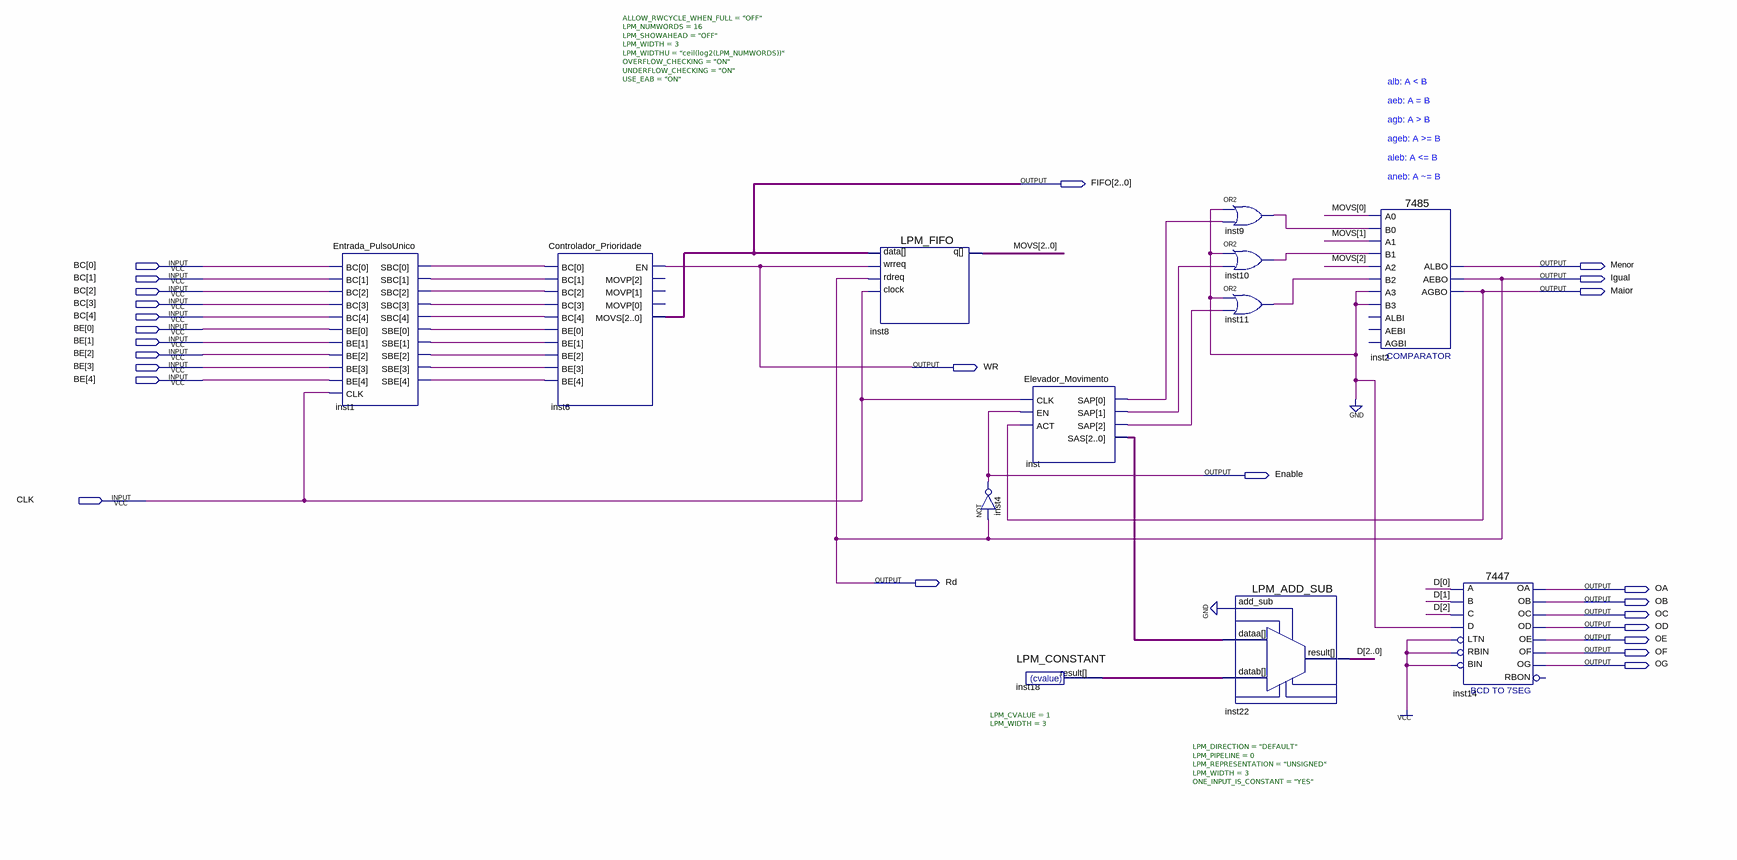
[diagram p0: schematic sheet]
// Quartus schematic Elevador_BetaV2.bdf as structural Verilog: 12 symbols, 25 pins
module Elevador_BetaV2 (
  input  [4:0] BC,
  input  [4:0] BE,
  input  CLK,
  output [2:0] FIFO,
  output Menor,
  output Igual,
  output Maior,
  output WR,
  output Enable,
  output Rd,
  output OA,
  output OB,
  output OC,
  output OD,
  output OE,
  output OF,
  output OG
);

  wire inst1_sbc, inst1_sbc_2, inst1_sbc_3, inst1_sbc_4, inst1_sbc_5, inst1_sbe, inst1_sbe_2, inst1_sbe_3,
       inst1_sbe_4, inst1_sbe_5, inst9_out, inst10_out, inst11_out, inst_sap, inst_sap_2, inst_sap_3;
  wire [2:0] D, inst18_result, inst_sas, MOVS;

  Entrada_PulsoUnico inst1 (
    .BC(BC), .BE(BE), .CLK(CLK), .SBC({inst1_sbc_5, inst1_sbc_4, inst1_sbc_3, inst1_sbc_2, inst1_sbc}),
    .SBE({inst1_sbe_5, inst1_sbe_4, inst1_sbe_3, inst1_sbe_2, inst1_sbe}));
  Controlador_Prioridade inst6 (
    .BC({inst1_sbc_5, inst1_sbc_4, inst1_sbc_3, inst1_sbc_2, inst1_sbc}),
    .BE({inst1_sbe_5, inst1_sbe_4, inst1_sbe_3, inst1_sbe_2, inst1_sbe}), .EN(WR), .MOVS(FIFO));  // open: MOVP
  LPM_FIFO #(.ALLOW_RWCYCLE_WHEN_FULL("OFF"), .LPM_NUMWORDS(16), .LPM_SHOWAHEAD("OFF"), .LPM_WIDTH(3), .LPM_WIDTHU("ceil(log2(LPM_NUMWORDS))"), .OVERFLOW_CHECKING("ON"), .UNDERFLOW_CHECKING("ON"), .USE_EAB("ON")) inst8 (
    .clock(CLK), .data(FIFO), .rdreq(Igual), .wrreq(WR), .q(MOVS));
  Elevador_Movimento inst (
    .CLK(CLK), .EN(Enable), .ACT(Maior), .SAP({inst_sap_2, inst_sap, inst_sap_3}), .SAS(inst_sas));
  not inst4 (Enable, Igual);
  LPM_CONSTANT #(.LPM_CVALUE(1), .LPM_WIDTH(3)) inst18 (.result(inst18_result));
  or inst9 (inst9_out, 1'b0, inst_sap_3);
  or inst10 (inst10_out, 1'b0, inst_sap);
  or inst11 (inst11_out, 1'b0, inst_sap_2);
  LPM_ADD_SUB #(.LPM_DIRECTION("DEFAULT"), .LPM_PIPELINE(0), .LPM_REPRESENTATION("UNSIGNED"), .LPM_WIDTH(3), .ONE_INPUT_IS_CONSTANT("YES")) inst22 (
    .add_sub(1'b0), .dataa(inst_sas), .datab(inst18_result), .result(D));
  \7485  inst2 (
    .A3(1'b0), .B2(inst11_out), .A2(MOVS[2]), .A0(MOVS[0]), .B0(inst9_out), .B3(1'b0), .A1(MOVS[1]),
    .B1(inst10_out), .ALBO(Menor), .AGBO(Maior), .AEBO(Igual));  // open: AEBI, AGBI, ALBI
  \7447  inst14 (
    .LTN(1'b1), .B(D[1]), .C(D[2]), .D(1'b0), .RBIN(1'b1), .BIN(1'b1), .A(D[0]), .OB(OB), .OC(OC), .OE(OE),
    .OD(OD), .OF(OF), .OG(OG), .OA(OA));  // open: RBON

  assign Rd = Igual;

  // Notes on the sheet:
  //   alb: A < B
  //   aeb: A = B
  //   agb: A > B
  //   ageb: A >= B
  //   aleb: A <= B
  //   aneb: A ~= B
endmodule
